# EAGLE design datalogger (EAGLE 5.12)
DATABASE: /home/matthew/work/eagle/partsdb.txt; PARTNO: MAX4820EUP+
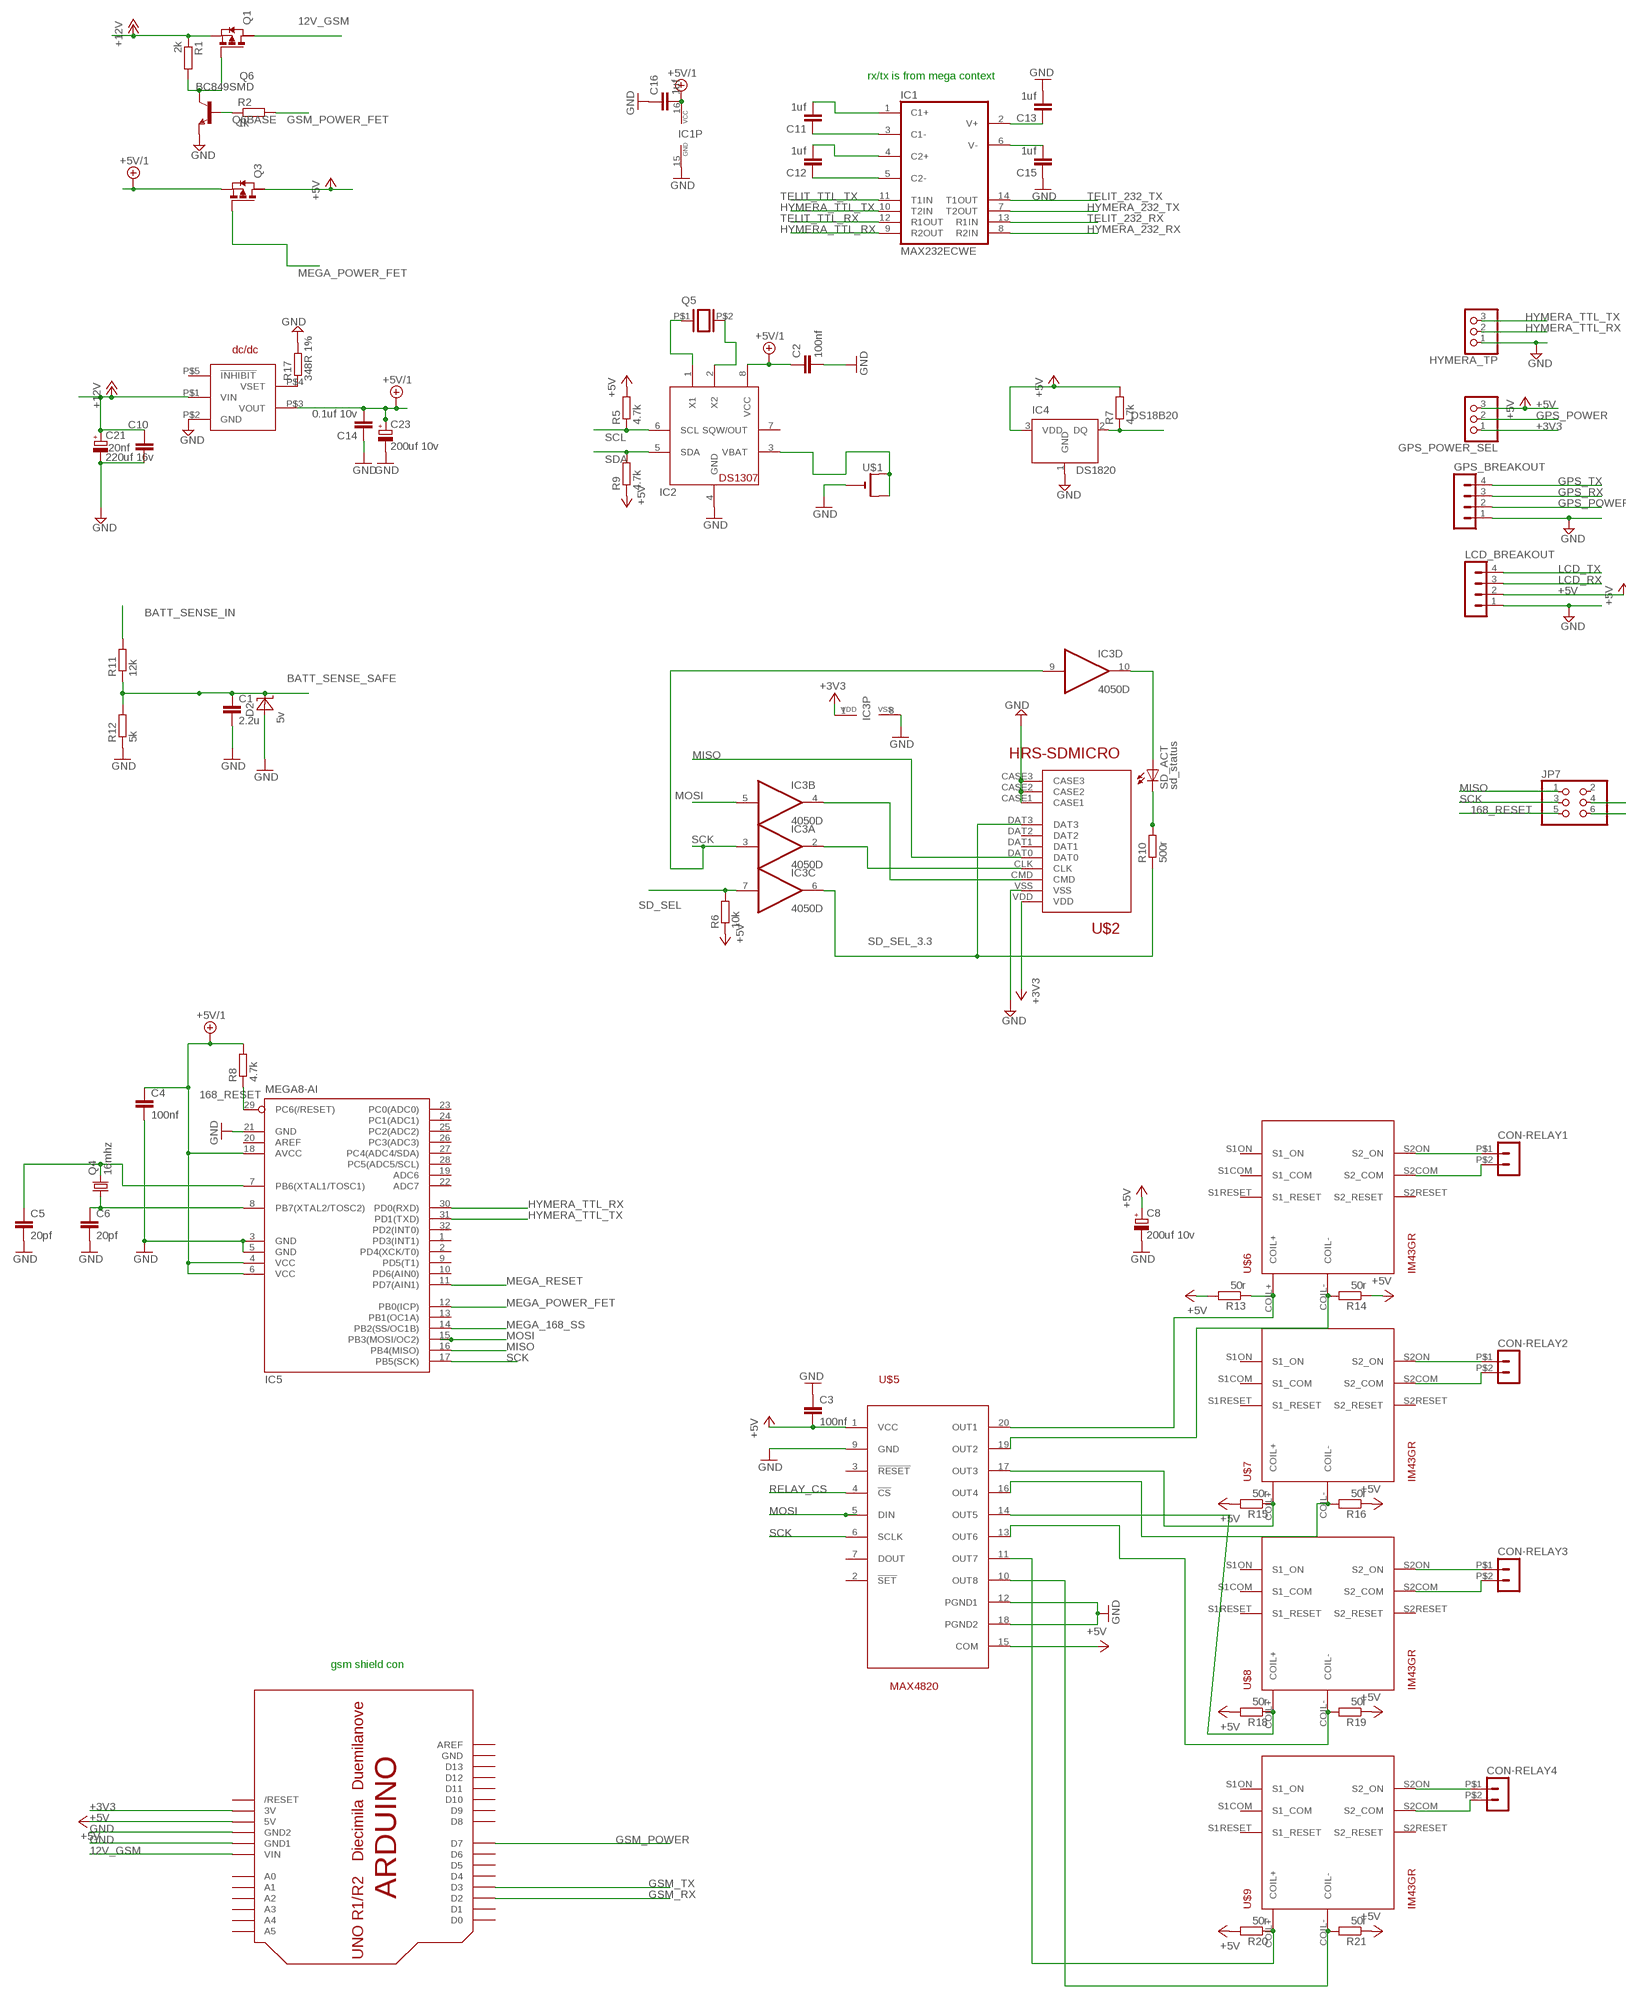
[diagram p0: schematic, sheet 1, part 1 of 3]
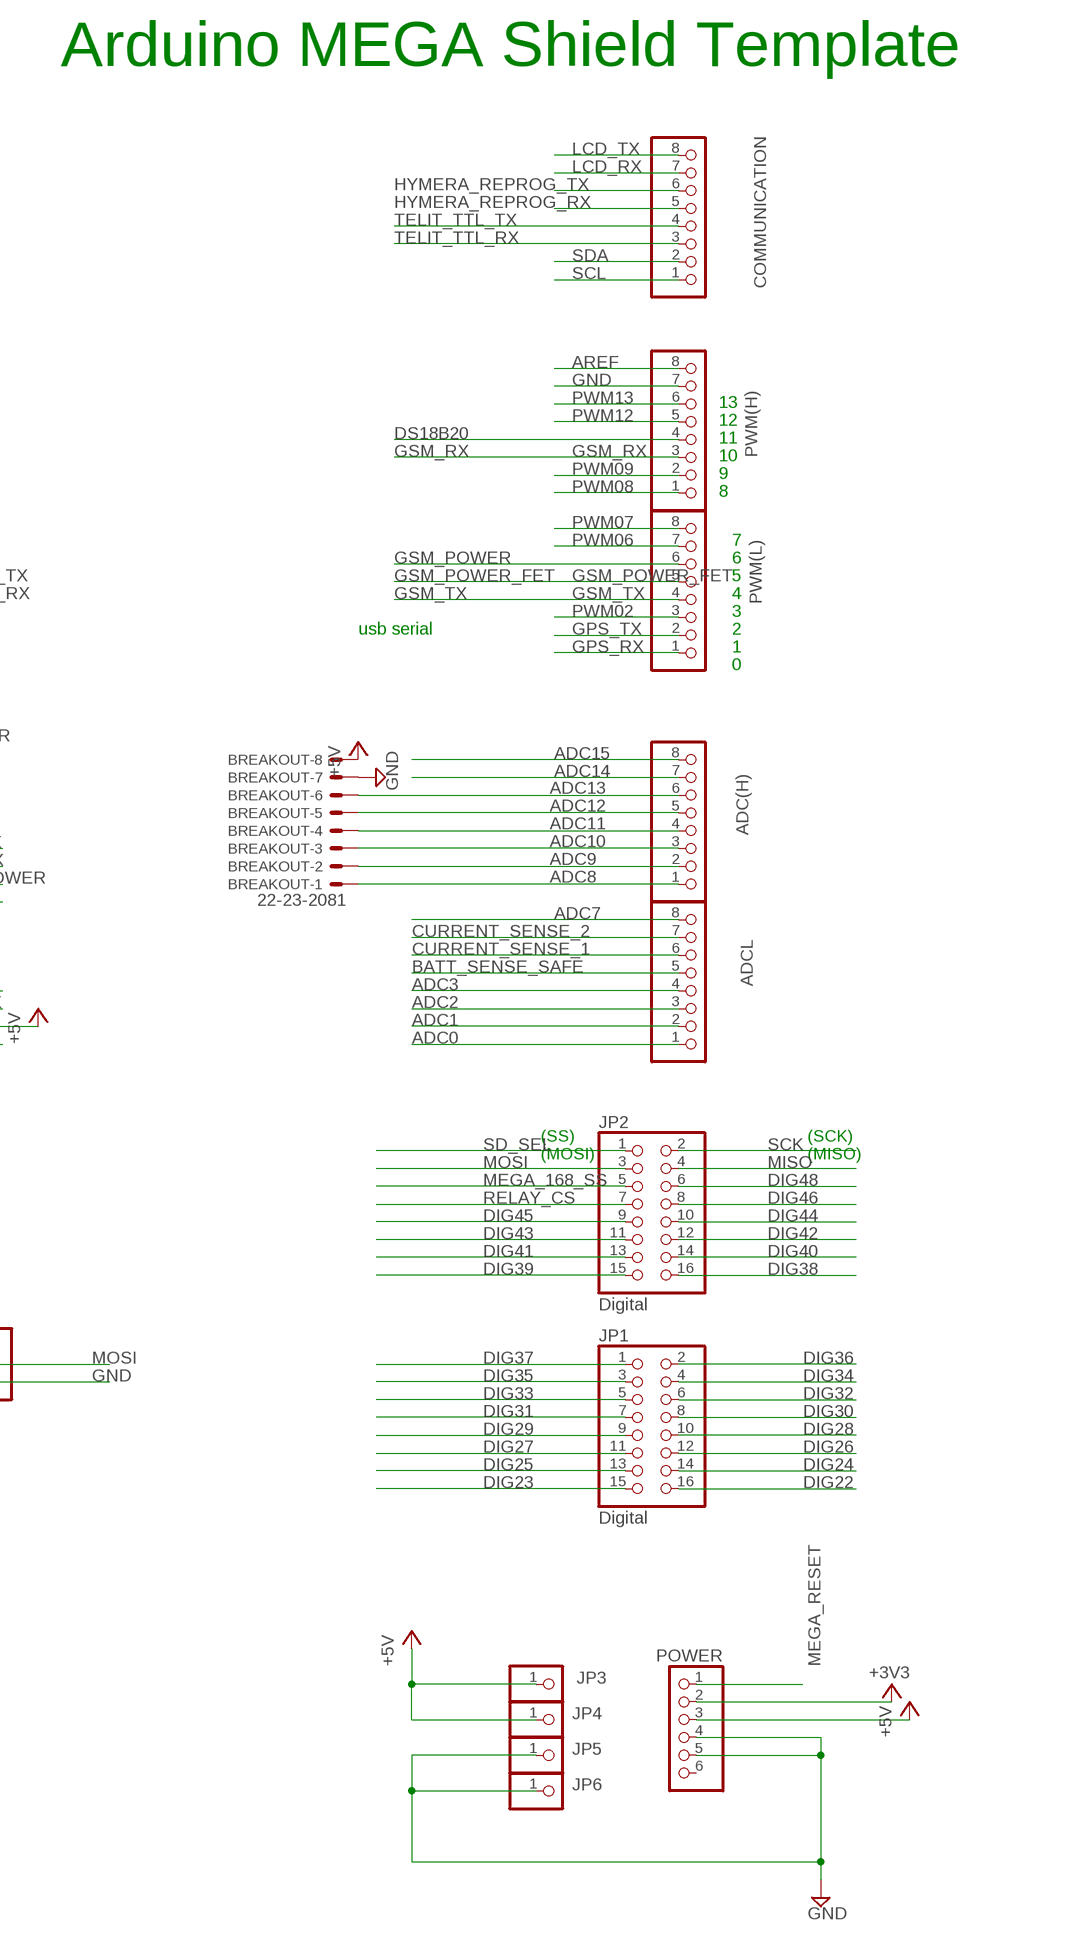
[diagram p1: schematic, sheet 1, part 2 of 3]
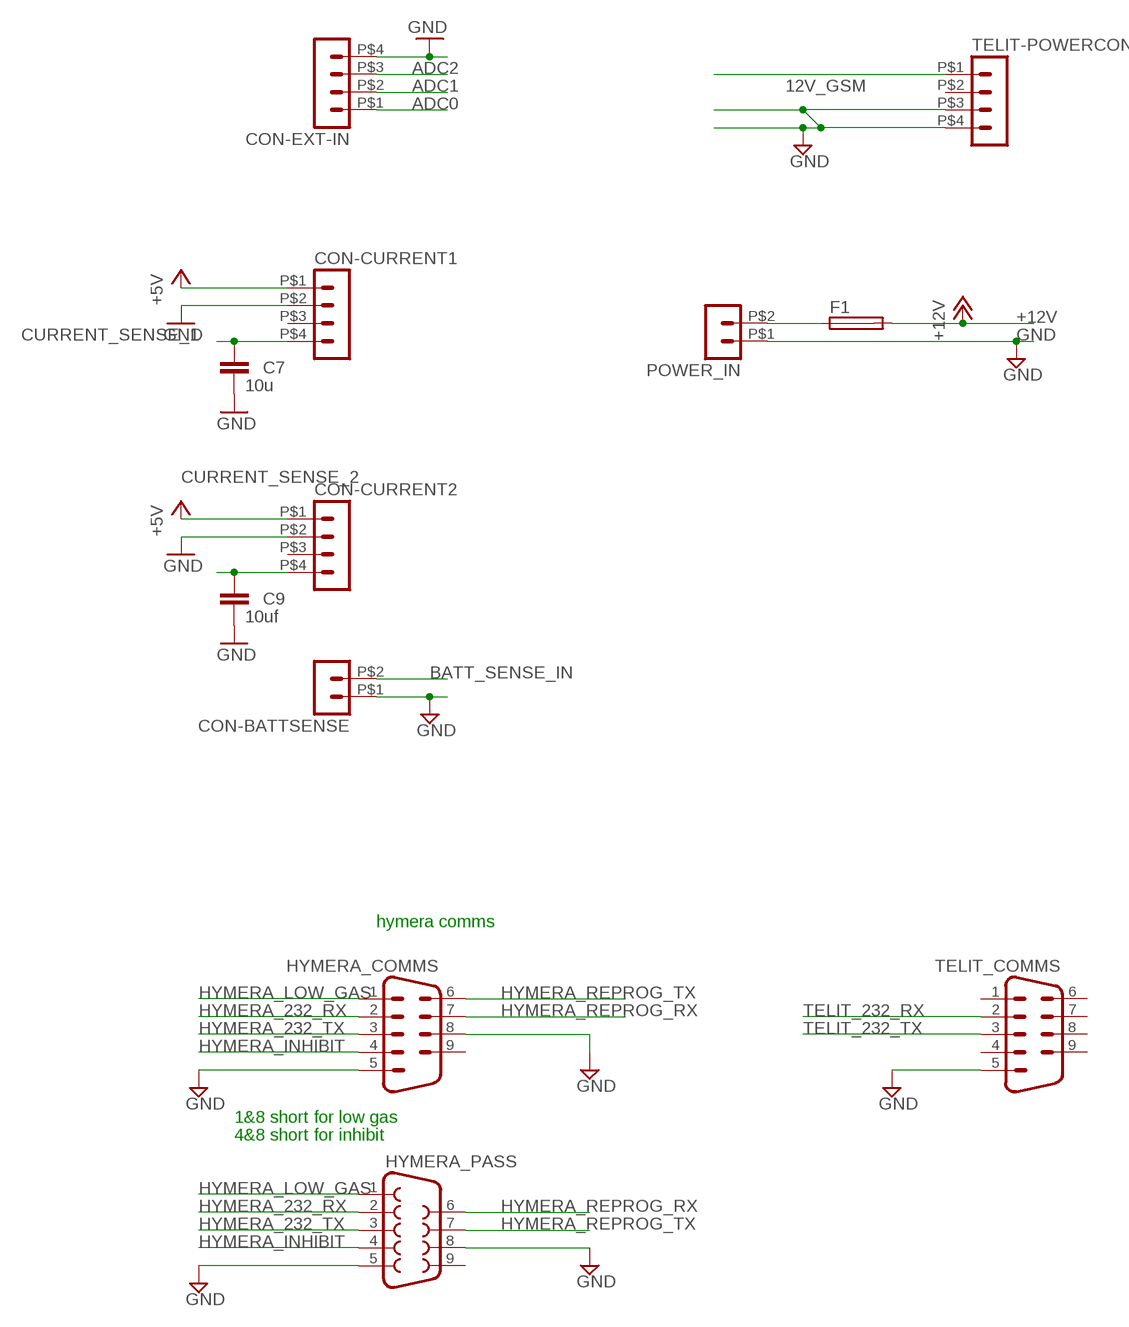
[diagram p2: schematic, sheet 1, part 3 of 3]

## Parts
ADC(H)  PINHD-1X8  [1X08]
ADCL  PINHD-1X8  [1X08]
BREAKOUT  22-23-2081  [22-23-2081]
C1  2.2u  C-EUC1206  [C1206]
C2  100nf  C-EUC1206  [C1206]
C3  100nf  C-EUC1206  [C1206]
C4  100nf  C-EUC1206  [C1206]
C5  20pf  C-EUC1206  [C1206]
C6  20pf  C-EUC1206  [C1206]
C7  10u  C-EUC1206  [C1206]
C8  200uf 10v  CPOL-EU153CLV-0505  [153CLV-0505]
C9  10uf  C-EUC1206  [C1206]
C10  20nf  C-EUC1206  [C1206]
C11  1uf  C-EUC1206  [C1206]
C12  1uf  C-EUC1206  [C1206]
C13  1uf  C-EUC1206  [C1206]
C14  0.1uf 10v  C-EUC1206  [C1206]
C15  1uf  C-EUC1206  [C1206]
C16  1uf  C-EUC1206  [C1206]
C21  220uf 16v  CPOL-EU153CLV-0810  [153CLV-0810]
C23  200uf 10v  CPOL-EU153CLV-0505  [153CLV-0505]
COMMUNICATION  PINHD-1X8  [1X08]
CON-BATTSENSE  HEADER_POS2_43045-0200  [43045-0200]
CON-CURRENT1  HEADER_POS4_43045-0401  [43045-0400]
CON-CURRENT2  HEADER_POS4_43045-0401  [43045-0400]
CON-EXT-IN  HEADER_POS4_43045-0401  [43045-0400]
CON-RELAY1  HEADER_POS2_43045-0200  [43045-0200]
CON-RELAY2  HEADER_POS2_43045-0200  [43045-0200]
CON-RELAY3  HEADER_POS2_43045-0200  [43045-0200]
CON-RELAY4  HEADER_POS2_43045-0200  [43045-0200]
D2  5v  1206ZENER  [C1206]
F1  SH22,5  [SH22,5]
GPS_BREAKOUT  MA04-1  [MA04-1]
GPS_POWER_SEL  PINHD-1X3  [1X03]
HYMERA_COMMS  M09H  [M09H]
HYMERA_PASS  F09H  [F09H]
HYMERA_TP  PINHD-1X3  [1X03]
IC1  MAX232ECWE  [SO16L]
IC2  DS1307  DS1307SOO8  [SO08]
IC3  4050D  [SO16]
IC4  DS1820  [TO-92]
IC5  MEGA8-AI  [TQFP32-08]
JP1  Digital  PINHD-2X8  [2X08]
JP2  Digital  PINHD-2X8  [2X08]
JP3  PINHD-1X1  [1X01]
JP4  PINHD-1X1  [1X01]
JP5  PINHD-1X1  [1X01]
JP6  PINHD-1X1  [1X01]
JP7  PINHD-2X3  [2X03]
LCD_BREAKOUT  MA04-1  [MA04-1]
POWER  PINHD-1X6  [1X06]
POWER_IN  HEADER_POS2_43045-0200  [43045-0200]
PWM(H)  PINHD-1X8  [1X08]
PWM(L)  PINHD-1X8  [1X08]
Q1  PMOSSOT223  [SOT223]
Q3  PMOSSOT223  [SOT223]
Q4  16mhz  CRYSTALHC49UP  [HC49UP]
Q5  XTALSMT  [CC4VCRYSTAL]
Q6  BC849SMD  [SOT23-BEC]
R1  2k  R-EU_M1206  [M1206]
R2  1k  R-EU_M1206  [M1206]
R5  4.7k  R-EU_R1206  [R1206]
R6  10k  R-EU_R1206  [R1206]
R7  4.7k  R-EU_M1206  [M1206]
R8  4.7k  R-EU_R1206  [R1206]
R9  4.7k  R-EU_R1206  [R1206]
R10  500r  R-EU_R1206  [R1206]
R11  12k  R-EU_R1206  [R1206]
R12  5k  R-EU_R1206  [R1206]
R13  50r  R-EU_R1206  [R1206]
R14  50r  R-EU_R1206  [R1206]
R15  50r  R-EU_R1206  [R1206]
R16  50r  R-EU_R1206  [R1206]
R17  348R 1%  R-EU_R1206  [R1206]
R18  50r  R-EU_R1206  [R1206]
R19  50r  R-EU_R1206  [R1206]
R20  50r  R-EU_R1206  [R1206]
R21  50r  R-EU_R1206  [R1206]
SD_ACT  sd_status  LEDSMT1206  [1206]
TELIT-POWERCON  HEADER_POS4_43045-0401  [43045-0400]
TELIT_COMMS  M09H  [M09H]
U$1  CR1220SMT  [CR1220-SMD]
U$2  HRS-SDMICRO  [HRS-MICROSD]
U$3  ARDUINO-NODIM  [ARDUINO-NODIM]
U$4  PTH08080WAH  [PTH08080WAH]
U$5  MAX4820  [TSSOP20]
U$6  IM43GR  [IM43GR]
U$7  IM43GR  [IM43GR]
U$8  IM43GR  [IM43GR]
U$9  IM43GR  [IM43GR]

## Nets
12V_GSM [power]: Q1.2(D) TELIT-POWERCON.P$1 U$3.VIN
168_RESET: IC5.29(PC6(/RESET)) JP7.5 R8.1
+3V3 [power]: GPS_POWER_SEL.1 IC3.1(P:VDD) POWER.2 U$2.VDD U$3.3V
+5V: BREAKOUT.8 C3.2 C8.+ CON-CURRENT1.P$1 CON-CURRENT2.P$1 GPS_POWER_SEL.3 IC4.3(VDD) JP3.1 JP4.1 LCD_BREAKOUT.2 POWER.3 Q3.2(D) R5.2 R6.1 R7.2 R9.1 R13.2 R14.1 R15.2 R16.1 R18.2 R19.1 R20.2 R21.1 U$3.5V U$5.1(VCC) U$5.15(COM)
+5V/1: C2.1 C4.1 C14.2 C16.2 C23.+ IC1.16(VCC) IC2.8(VCC) IC5.4(VCC) IC5.6(VCC) IC5.18(AVCC) Q3.3(S) R8.2 U$4.P$3(VOUT)
+12V [power]: C10.1 C21.+ F1.2 Q1.3(S) R1.1 U$4.P$1(VIN)
ADC0: ADCL.1 CON-EXT-IN.P$1
ADC1: ADCL.2 CON-EXT-IN.P$2
ADC2: ADCL.3 CON-EXT-IN.P$3
ADC3: ADCL.4
ADC7: ADCL.8
ADC8: ADC(H).1 BREAKOUT.1
ADC9: ADC(H).2 BREAKOUT.2
ADC10: ADC(H).3 BREAKOUT.3
ADC11: ADC(H).4 BREAKOUT.4
ADC12: ADC(H).5 BREAKOUT.5
ADC13: ADC(H).6 BREAKOUT.6
ADC14: ADC(H).7
ADC15: ADC(H).8
AREF: PWM(H).8
BATT_SENSE_IN [power]: CON-BATTSENSE.P$2 R11.2
BATT_SENSE_SAFE: ADCL.5 C1.1 D2.CATHODE(C) R11.1 R12.2
CURRENT_SENSE_1: ADCL.6 C7.1 CON-CURRENT1.P$4
CURRENT_SENSE_2: ADCL.7 C9.1 CON-CURRENT2.P$4
DIG22: JP1.16
DIG23: JP1.15
DIG24: JP1.14
DIG25: JP1.13
DIG26 [gnd]: JP1.12
DIG27: JP1.11
DIG28: JP1.10
DIG29: JP1.9
DIG30: JP1.8
DIG31: JP1.7
DIG32: JP1.6
DIG33: JP1.5
DIG34: JP1.4
DIG35: JP1.3
DIG36: JP1.2
DIG37: JP1.1
DIG38: JP2.16
DIG39: JP2.15
DIG40: JP2.14
DIG41: JP2.13
DIG42: JP2.12
DIG43: JP2.11
DIG44: JP2.10
DIG45: JP2.9
DIG46: JP2.8
DIG48: JP2.6
DS18B20: IC4.2(DQ) PWM(H).4 R7.1
GND [gnd]: BREAKOUT.7 C1.2 C2.2 C3.1 C4.2 C5.2 C6.2 C7.2 C8.- C9.2 C10.2 C13.2 C14.1 C15.1 C16.1 C21.- C23.- CON-BATTSENSE.P$1 CON-CURRENT1.P$2 CON-CURRENT2.P$2 CON-EXT-IN.P$4 D2.ANODE(A) GPS_BREAKOUT.1 HYMERA_COMMS.5 HYMERA_COMMS.8 HYMERA_PASS.5 HYMERA_PASS.8 HYMERA_TP.1 IC1.15(GND) IC2.4(GND) IC3.8(P:VSS) IC4.1(GND) IC5.3(GND) IC5.5(GND) IC5.21(GND) JP5.1 JP6.1 JP7.6 LCD_BREAKOUT.1 POWER.4 POWER.5 POWER_IN.P$1 PWM(H).7 Q6.E R12.1 R17.2 TELIT-POWERCON.P$3 TELIT-POWERCON.P$4 TELIT_COMMS.5 U$1.- U$2.CASE1 U$2.CASE2 U$2.CASE3 U$2.VSS U$3.GND1 U$3.GND2 U$4.P$2(GND) U$5.9(GND) U$5.12(PGND1) U$5.18(PGND2)
GPS_POWER: GPS_BREAKOUT.2 GPS_POWER_SEL.2
GPS_RX: GPS_BREAKOUT.3 PWM(L).1
GPS_TX: GPS_BREAKOUT.4 PWM(L).2
GSM_POWER: PWM(L).6 U$3.D7
GSM_POWER_FET: PWM(L).5 R2.2
GSM_RX: PWM(H).3 U$3.D2
GSM_TX: PWM(L).4 U$3.D3
HYMERA_232_RX: HYMERA_COMMS.2 HYMERA_PASS.2 IC1.8(R2IN)
HYMERA_232_TX: HYMERA_COMMS.3 HYMERA_PASS.3 IC1.7(T2OUT)
HYMERA_INHIBIT: HYMERA_COMMS.4 HYMERA_PASS.4
HYMERA_LOW_GAS: HYMERA_COMMS.1 HYMERA_PASS.1
HYMERA_REPROG_RX: COMMUNICATION.5 HYMERA_COMMS.7 HYMERA_PASS.6
HYMERA_REPROG_TX: COMMUNICATION.6 HYMERA_COMMS.6 HYMERA_PASS.7
HYMERA_TTL_RX: HYMERA_TP.2 IC1.9(R2OUT) IC5.30(PD0(RXD))
HYMERA_TTL_TX: HYMERA_TP.3 IC1.10(T2IN) IC5.31(PD1(TXD))
LCD_RX: COMMUNICATION.7 LCD_BREAKOUT.3
LCD_TX: COMMUNICATION.8 LCD_BREAKOUT.4
MEGA_168_SS: IC5.14(PB2(SS/OC1B)) JP2.5
MEGA_POWER_FET: IC5.12(PB0(ICP)) Q3.1(G)
MEGA_RESET: IC5.11(PD7(AIN1)) POWER.1
MISO: IC5.16(PB4(MISO)) JP2.4 JP7.1 U$2.DAT0
MOSI: IC3.5(B:I) IC5.15(PB3(MOSI/OC2)) JP2.3 JP7.4 U$5.5(DIN)
MOSI_3.3: IC3.4(B:O) U$2.CMD
N$2: Q1.1(G) Q6.C R1.2
N$3 [power]: F1.1 POWER_IN.P$2
N$4: CON-RELAY1.P$1 U$6.S2ON(S2_ON)
N$5: R17.1 U$4.P$4(VSET)
N$6: IC2.1(X1) Q5.P$1
N$7: IC2.3(VBAT) U$1.+$1(+) U$1.+$2(+1)
N$8: C6.1 IC5.8(PB7(XTAL2/TOSC2)) Q4.1
N$9: IC2.2(X2) Q5.P$2
N$10: IC3.10(D:O) SD_ACT.A
N$11: C5.1 IC5.7(PB6(XTAL1/TOSC1)) Q4.2
N$12: CON-RELAY1.P$2 U$6.S2COM(S2_COM)
N$14: CON-RELAY2.P$1 U$7.S2ON(S2_ON)
N$15: CON-RELAY2.P$2 U$7.S2COM(S2_COM)
N$16: CON-RELAY3.P$1 U$8.S2ON(S2_ON)
N$17: CON-RELAY3.P$2 U$8.S2COM(S2_COM)
N$18: R10.2 SD_ACT.C
N$19: CON-RELAY4.P$1 U$9.S2ON(S2_ON)
N$20: CON-RELAY4.P$2 U$9.S2COM(S2_COM)
N$21: R13.1 U$5.20(OUT1) U$6.COIL+
N$22: R14.2 U$5.19(OUT2) U$6.COIL-
N$23: R15.1 U$5.17(OUT3) U$7.COIL+
N$24: R16.2 U$5.16(OUT4) U$7.COIL-
N$25: R18.1 U$5.14(OUT5) U$8.COIL+
N$26: R19.2 U$5.13(OUT6) U$8.COIL-
N$27: R20.1 U$5.11(OUT7) U$9.COIL+
N$28: R21.2 U$5.10(OUT8) U$9.COIL-
N$30: C12.1 IC1.5(C2-)
N$31: C12.2 IC1.4(C2+)
N$32: C11.1 IC1.3(C1-)
N$33: C11.2 IC1.1(C1+)
N$34: C13.1 IC1.2(V+)
N$35: C15.2 IC1.6(V-)
PWM02: PWM(L).3
PWM06: PWM(L).7
PWM07: PWM(L).8
PWM08: PWM(H).1
PWM09: PWM(H).2
PWM12: PWM(H).5
PWM13: PWM(H).6
Q6BASE: Q6.B R2.1
RELAY_CS: JP2.7 U$5.4(!CS)
SCK: IC3.3(A:I) IC3.9(D:I) IC5.17(PB5(SCK)) JP2.2 JP7.3 U$5.6(SCLK)
SCK_3.3: IC3.2(A:O) U$2.CLK
SCL: COMMUNICATION.1 IC2.6(SCL) R5.1
SD_SEL: IC3.7(C:I) JP2.1 R6.2
SD_SEL_3.3: IC3.6(C:O) R10.1 U$2.DAT3
SDA: COMMUNICATION.2 IC2.5(SDA) R9.2
TELIT_232_RX: IC1.13(R1IN) TELIT_COMMS.2
TELIT_232_TX: IC1.14(T1OUT) TELIT_COMMS.3
TELIT_TTL_RX: COMMUNICATION.3 IC1.12(R1OUT)
TELIT_TTL_TX: COMMUNICATION.4 IC1.11(T1IN)
Unconnected: CON-CURRENT1.P$3 CON-CURRENT2.P$3 HYMERA_COMMS.9 HYMERA_PASS.9 IC2.7(SQW/OUT) IC3.11(E:I) IC3.12(E:O) IC3.14(F:I) IC3.15(F:O) IC5.1(PD3(INT1)) IC5.2(PD4(XCK/T0)) IC5.9(PD5(T1)) IC5.10(PD6(AIN0)) IC5.13(PB1(OC1A)) IC5.19(ADC6) IC5.20(AREF) IC5.22(ADC7) IC5.23(PC0(ADC0)) IC5.24(PC1(ADC1)) IC5.25(PC2(ADC2)) IC5.26(PC3(ADC3)) IC5.27(PC4(ADC4/SDA)) IC5.28(PC5(ADC5/SCL)) IC5.32(PD2(INT0)) JP7.2 POWER.6 Q1.4(D2) Q3.4(D2) TELIT-POWERCON.P$2 TELIT_COMMS.1 TELIT_COMMS.4 TELIT_COMMS.6 TELIT_COMMS.7 TELIT_COMMS.8 TELIT_COMMS.9 U$2.DAT1 U$2.DAT2 U$3.A0 U$3.A1 U$3.A2 U$3.A3 U$3.A4 U$3.A5 U$3.AREF U$3.D0 U$3.D1 U$3.D4 U$3.D5 U$3.D6 U$3.D8 U$3.D9 U$3.D10 U$3.D11 U$3.D12 U$3.D13 U$3.RESET(/RESET) U$4.P$5(!INHIBIT) U$5.2(!SET) U$5.3(!RESET) U$5.7(DOUT) U$6.S1COM(S1_COM) U$6.S1ON(S1_ON) U$6.S1RESET(S1_RESET) U$6.S2RESET(S2_RESET) U$7.S1COM(S1_COM) U$7.S1ON(S1_ON) U$7.S1RESET(S1_RESET) U$7.S2RESET(S2_RESET) U$8.S1COM(S1_COM) U$8.S1ON(S1_ON) U$8.S1RESET(S1_RESET) U$8.S2RESET(S2_RESET) U$9.S1COM(S1_COM) U$9.S1ON(S1_ON) U$9.S1RESET(S1_RESET) U$9.S2RESET(S2_RESET)

## Notes on the sheet
- Arduino MEGA Shield Template
- rx/tx is from mega context
- 13
- 12
- 11
- 10
- 9
- 8
- 7
- 6
- 5
- 4
- 3
- usb serial | 2
- 1
- 0
- (SS) | (SCK)
- (MOSI) | (MISO)
- gsm shield con
- hymera comms
- 1&8 short for low gas
- 4&8 short for inhibit

## Power pins joined to a net without a drawn wire
GND: U$3.GND

## Library data of the parts
ADC(H) ADCL COMMUNICATION PWM(H) PWM(L) = pinhead:PINHD-1X8: PIN HEADER
BREAKOUT = con-molex:22-23-2081: .100" (2.54mm) Center Header - 8 Pin; MF: MOLEX; MPN: 22-23-2081; OC_FARNELL: 1756826; OC_NEWARK: 01C7592
C1-C7 C9 C11-C13 C15 C16 = matt rcl:C-EU: CAPACITOR, European symbol
C8 C23 = rcl:CPOL-EU: POLARIZED CAPACITOR, European symbol
C10 C14 = resistor:C-EU: CAPACITOR, European symbol
C21 = matt rcl:CPOL-EU: POLARIZED CAPACITOR, European symbol
CON-BATTSENSE CON-RELAY1-CON-RELAY4 POWER_IN = con-molex-5569:HEADER_POS2_?: Molex - Micro-Fit 3.0 Series connector, 3.00mm (0.118") pitch header, 2 positions.
CON-CURRENT1 CON-CURRENT2 CON-EXT-IN TELIT-POWERCON = con-molex-5569:HEADER_POS4_?: Molex - Micro-Fit 3.0 Series connector, 3.00mm (0.118") pitch header, 4 positions.
D2 = matt diode:1206ZENER
F1 = fuse:SH22,5: FUSE HOLDER grid 22,5 mm, OGN0031 8201, Schurter (Buerklin); MF: SCHURTER; MPN: 0031.8201; OC_FARNELL: 1162740; OC_NEWARK: 96F8317
GPS_BREAKOUT LCD_BREAKOUT = con-lstb:MA04-1: PIN HEADER; OC_FARNELL: unknown; OC_NEWARK: unknown
GPS_POWER_SEL HYMERA_TP = adafruit:PINHD-1X3: PIN HEADER
HYMERA_COMMS TELIT_COMMS = con-subd:M09: SUB-D; OC_FARNELL: unknown; OC_NEWARK: unknown
HYMERA_PASS = con-subd:F09: SUB-D; OC_FARNELL: unknown; OC_NEWARK: unknown
IC1 = maxim:MAX232ECWE: RS232 TRANSEIVER; MF: MAXIM; MPN: MAX232ECWE+; OC_FARNELL: 9724435; OC_NEWARK: 67K4440
IC2 = adafruit:DS1307: DS1307 Real time clock (RTC) with battery backup ability. Talk to it via i2c
IC3 = 40xx:4050: Hex non-inverting BUFFER
IC4 = DS1820:DS1820: DS1820 - 1-Wire Digital Thermometer
IC5 = matt atmel:MEGA8: MICROCONTROLLER 8 Kbytes FLASH, 1 kbytes SRAM, 512 bytes EEPROM, USART, 6-channel 10 bit ADC, 2-channel 8 bit ADC Pin compatible with Atmega48, ATMega88, ATMega168 Source: avr.lbr
JP1 JP2 = pinhead:PINHD-2X8: PIN HEADER
JP3-JP6 = pinhead:PINHD-1X1: PIN HEADER
JP7 = pinhead:PINHD-2X3: PIN HEADER
POWER = pinhead:PINHD-1X6: PIN HEADER
Q1 Q3 = zetex:PMOSSOT223: MOS FET; OC_FARNELL: unknown; OC_NEWARK: unknown
Q4 = crystal:CRYSTAL: CRYSTAL; OC_FARNELL: unknown; OC_NEWARK: unknown
Q5 = matt special:XTAL: CRYSTAL
Q6 = matt transistor-npn:BC849*: NPN Transistor
R1 R2 R7 = resistor:R-EU_: RESISTOR, European symbol
R5 R6 R8-R21 = matt rcl:R-EU_: RESISTOR, European symbol
SD_ACT = matt led:LED: LED OSRAM: - CHIPLED LG R971, LG N971, LY N971, LG Q971, LY Q971, LO R971, LY R971 LH N974, LH R974 LS Q976, LO Q976, LY Q976 LO Q996 - Hyper CHIPLED LW Q18S LB Q993, LB Q99A, LB R99A - SideLED LS A670, LO A670, LY A670, LG A670, LP A670 LB A673, LV A673, LT A673, LW A673 LH A674 LY A675 LS A676, LA A676, LO A676, LY A676, LW A676 LS A679, LY A679, LG A679 - Hyper Micro SIDELED® LS Y876, LA Y876, LO Y876, LY Y876 LT Y87S - SmartLED LW L88C, LW L88S LB L89C, LB L89S, LG L890 LS L89K, LO L89K, LY L89K LS L896, LA L896, LO L896, LY L896 - TOPLED LS T670, LO T670, LY T670, LG T670, LP T670 LSG T670, LSP T670, LSY T670, LOP T670, LYG T670 LG T671, LOG T671, LSG T671 LB T673, LV T673, LT T673, LW T673 LH T674 LS T676, LA T676, LO T676, LY T676, LB T676, LH T676, LSB T676, LW T676 LB T67C, LV T67C, LT T67C, LS T67K, LO T67K, LY T67K, LW E67C LS E67B, LA E67B, LO E67B, LY E67B, LB E67C, LV E67C, LT E67C LW T67C LS T679, LY T679, LG T679 LS T770, LO T770, LY T770, LG T770, LP T770 LB T773, LV T773, LT T773, LW T773 LH T774 LS E675, LA E675, LY E675, LS T675 LS T776, LA T776, LO T776, LY T776, LB T776 LHGB T686 LT T68C, LB T68C - Hyper Mini TOPLED® LB M676 - Mini TOPLED Santana® LG M470 LS M47K, LO M47K, LY M47K Source: http://www.osram.convergy.de LUXEON: - LUMILED® LXK2-PW12-R00, LXK2-PW12-S00, LXK2-PW14-U00, LXK2-PW14-V00 LXK2-PM12-R00, LXK2-PM12-S00, LXK2-PM14-U00 LXK2-PE12-Q00, LXK2-PE12-R00, LXK2-PE12-S00, LXK2-PE14-T00, LXK2-PE14-U00 LXK2-PB12-K00, LXK2-PB12-L00, LXK2-PB12-M00, LXK2-PB14-N00, LXK2-PB14-P00, LXK2-PB14-Q00 LXK2-PR12-L00, LXK2-PR12-M00, LXK2-PR14-Q00, LXK2-PR14-R00 LXK2-PD12-Q00, LXK2-PD12-R00, LXK2-PD12-S00 LXK2-PH12-R00, LXK2-PH12-S00 LXK2-PL12-P00, LXK2-PL12-Q00, LXK2-PL12-R00 Source: www.luxeon.com KINGBRIGHT: KA-3528ASYC Source: www.kingbright.com
U$1 = adafruit:CR1220: CR1216/CR1220/CR1225 12mm 3V lithium coin cell Great for battery packup. Both SMT and THM holders. Note the THM package has the ground pads on both sides of the PCB so that the masks are the same - this reduces the cost
U$2 = matt:HRS-SDMICRO
U$3 = adafruit:ARDUINO: Arduino Diecimila/Duemilanove Make a shield with ease, this package has all the named pins as well as the two mounting drill holes and an outline of the USB and DC power connector. The outline is on the DIMENSION layer, so if your board house uses it they will cut the outline to match. http://www.ladyada.net/library/pcb/eaglelibrary.html
U$4 = matt:PTH08080WAH
U$5 = matt:MAX4820
U$6-U$9 = matt:IM43GR

## Net classes
0 default: width 0.203 mm, drill 0.406 mm, clearance 0.203 mm
1 power: width 0.61 mm, drill 0.711 mm, clearance 0.203 mm
2 gnd: width 0.305 mm, drill 0.711 mm, clearance 0.203 mm
3 usbvcc: width 0.508 mm, drill 0.711 mm, clearance 0.203 mm

## Board
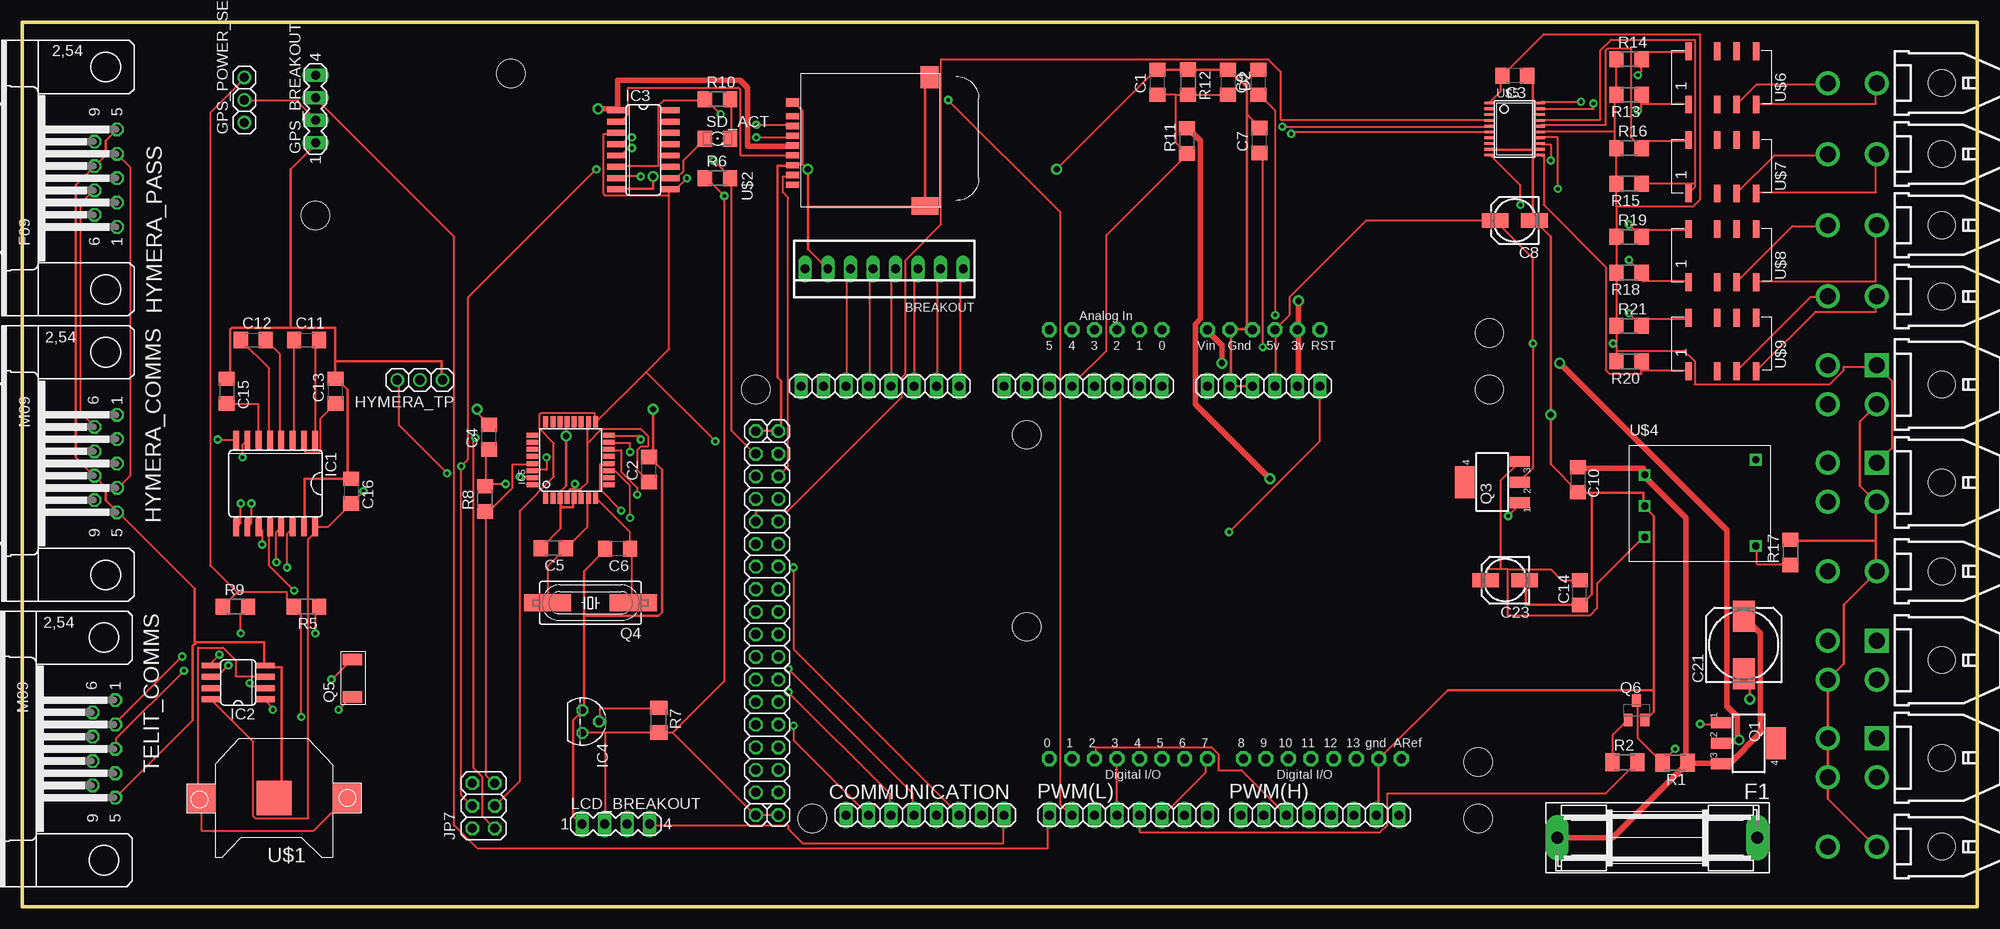
[diagram p3: board, top side]
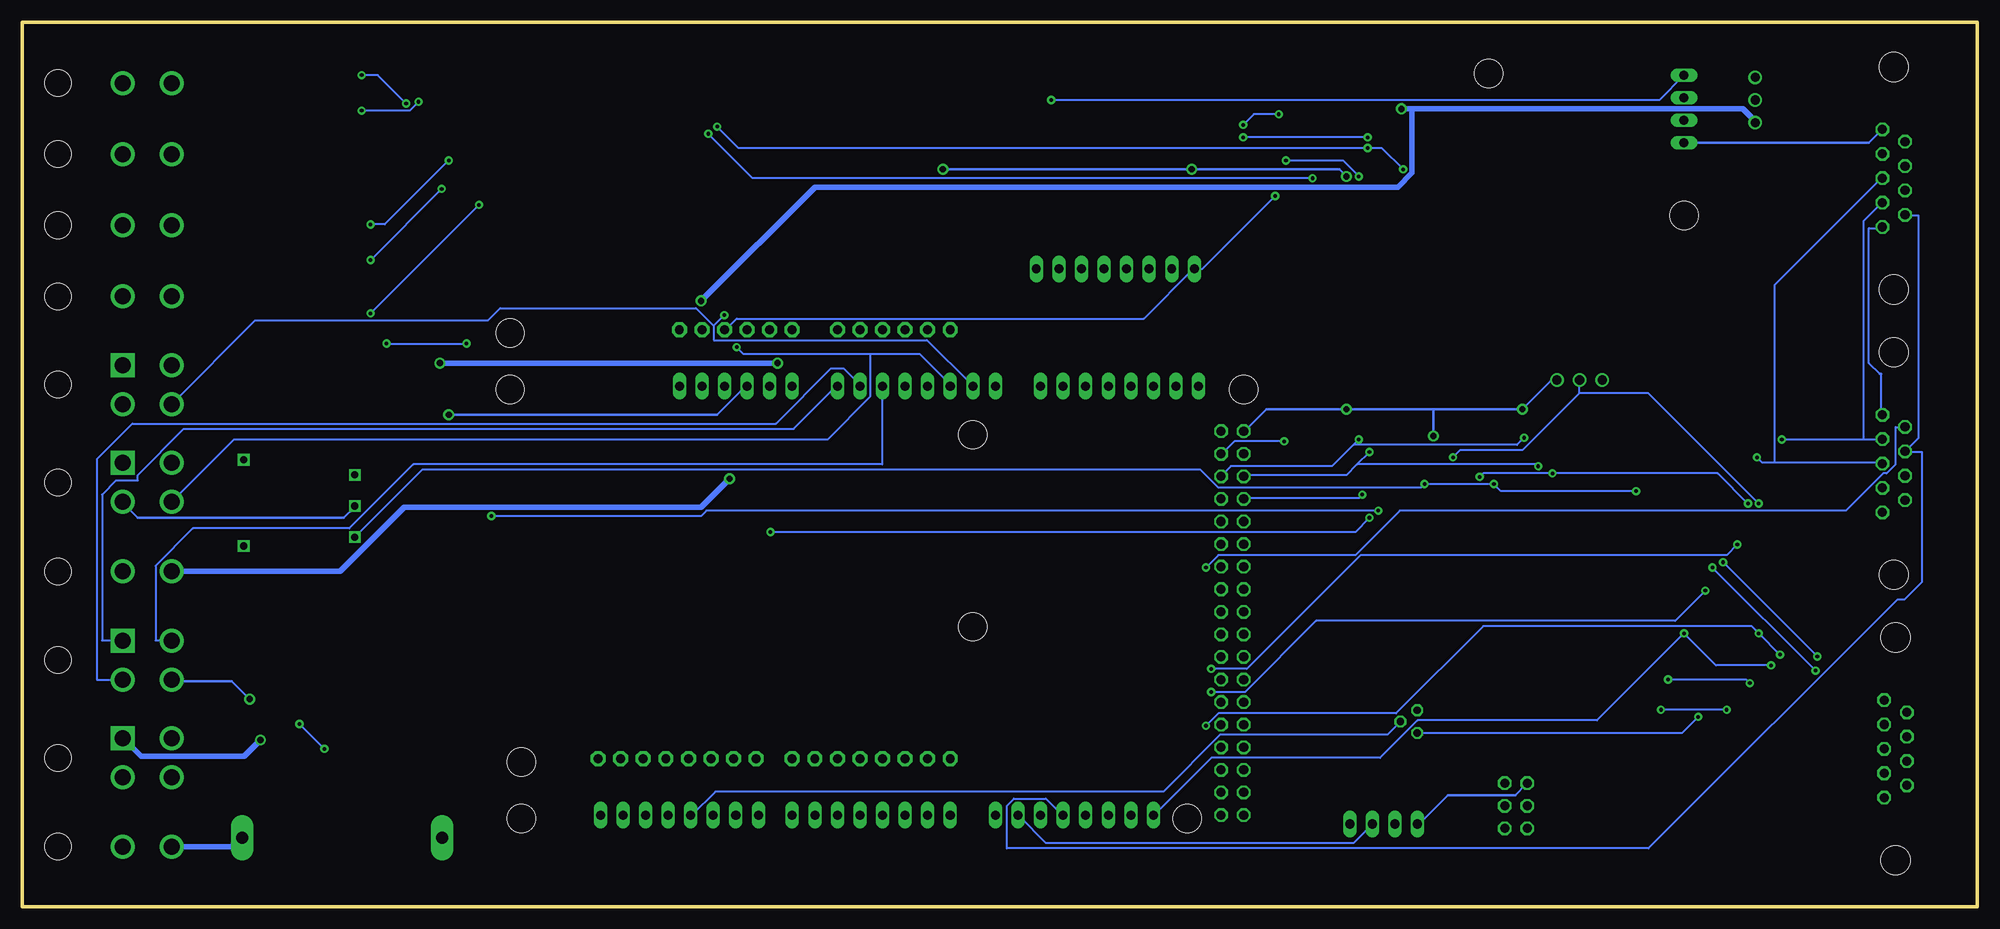
[diagram p4: board, bottom side, seen from below]

Size 220 x 99.5 mm. Coordinates in mm from the lower left corner, seen from the top.
Outline: 0,99.5 0,0 220,0 220,99.5 0,99.5
Copper layers (1*16): Top 0.035mm / dielectric 1.5mm / Bottom 0.035mm
Design rules "default *": minimum track width 8mil, minimum drill 16mil, track to track 8mil, track to pad 8mil, pad to pad 8mil, via to via 10mil, smd to smd 8mil, copper to edge 40mil, drill to drill 12mil, minimum pad ring 10mil, minimum via ring 10mil, stop-mask expansion 4mil, vias tented up to drill 0mil, thermal gap 10mil
Holes 3.2 mm at 55,93.75 33,77.75 165.1,58.17 113.03,53.09 82.55,58.17 88.9,9.91 163.83,9.91 163.83,16.26 165.1,64.52 113.03,31.5

### Footprints (pad centres in the part's own frame; a part is rotated, then mirrored left to right if it is on the bottom)
1X08 = drill 1.016 long: 1 -8.89,0; 2 -6.35,0; 3 -3.81,0; 4 -1.27,0; 5 1.27,0; 6 3.81,0; 7 6.35,0; 8 8.89,0
22-23-2081 = drill 1 long: 1 -8.89,0; 2 -6.35,0; 3 -3.81,0; 4 -1.27,0; 5 1.27,0; 6 3.81,0; 7 6.35,0; 8 8.89,0
C1206 = smd 1.6 x 1.8: 1 -1.4,0; 2 1.4,0
153CLV-0505 = smd 3 x 1.6: + 2.2,0; - -2.2,0
153CLV-0810 = smd 3.5 x 2.5: + 3.25,0; - -3.25,0
43045-0200 = drill 1.8 round: P$1 0,7.32; P$2 0,12.82 | hole 3: 0,0
43045-0400 = drill 1.8 square: P$1 2.2,7.3 | drill 1.8 round: P$2 -2.2,7.3; P$3 2.2,12.8; P$4 -2.2,12.8 | hole 3: 0,0
C1206' = smd 1.6 x 1.8: ANODE -1.4,0; CATHODE 1.4,0
SH22,5 = drill 1.321 pad 2.54 long: 1 -11.252,0; 2 11.252,0
MA04-1 = drill 1.016 long: 1 -3.81,0; 2 -1.27,0; 3 1.27,0; 4 3.81,0
1X03 = drill 1.016 round: 1 -2.54,0; 2 0,0; 3 2.54,0
M09H = drill 1.016 octagon: 1 -5.486,1.27; 2 -2.743,1.27; 3 0,1.27; 4 2.743,1.27; 5 5.486,1.27; 6 -4.115,-1.27; 7 -1.372,-1.27; 8 1.372,-1.27; 9 4.115,-1.27 | hole 3.302: 12.522,0; -12.522,0
F09H = drill 1.016 octagon: 1 -5.486,-1.27; 2 -2.743,-1.27; 3 0,-1.27; 4 2.743,-1.27; 5 5.486,-1.27; 6 -4.115,1.27; 7 -1.372,1.27; 8 1.372,1.27; 9 4.115,1.27 | hole 3.302: -12.522,0; 12.522,0
SO16L = smd 0.66 x 2.032: 1 -4.445,-4.902; 2 -3.175,-4.902; 3 -1.905,-4.902; 4 -0.635,-4.902; 5 0.635,-4.902; 6 1.905,-4.902; 7 3.175,-4.902; 8 4.445,-4.902; 9 4.445,4.902; 10 3.175,4.902; 11 1.905,4.902; 12 0.635,4.902; 13 -0.635,4.902; 14 -1.905,4.902; 15 -3.175,4.902; 16 -4.445,4.902
SO08 = smd 0.66 x 2.032: 1 -1.905,-3.073; 2 -0.635,-3.073; 3 0.635,-3.073; 4 1.905,-3.073; 5 1.905,3.073; 6 0.635,3.073; 7 -0.635,3.073; 8 -1.905,3.073
SO16 = smd 0.66 x 2.032: 1 -4.445,-3.073; 2 -3.175,-3.073; 3 -1.905,-3.073; 4 -0.635,-3.073; 5 0.635,-3.073; 6 1.905,-3.073; 7 3.175,-3.073; 8 4.445,-3.073; 9 4.445,3.073; 10 3.175,3.073; 11 1.905,3.073; 12 0.635,3.073; 13 -0.635,3.073; 14 -1.905,3.073; 15 -3.175,3.073; 16 -4.445,3.073
TO-92 = drill 0.813 pad 1.27 octagon: 1 -1.27,0; 2 0,1.905; 3 1.27,0
TQFP32-08 = smd 1.27 x 0.559: 1 -4.293,2.8; 2 -4.293,2; 3 -4.293,1.2; 4 -4.293,0.4; 5 -4.293,-0.4; 6 -4.293,-1.2; 7 -4.293,-2; 8 -4.293,-2.8; 17 4.293,-2.8; 18 4.293,-2; 19 4.293,-1.2; 20 4.293,-0.4; 21 4.293,0.4; 22 4.293,1.2; 23 4.293,2; 24 4.293,2.8 | smd 0.559 x 1.27: 9 -2.8,-4.293; 10 -2,-4.293; 11 -1.2,-4.293; 12 -0.4,-4.293; 13 0.4,-4.293; 14 1.2,-4.293; 15 2,-4.293; 16 2.8,-4.293; 25 2.8,4.293; 26 2,4.293; 27 1.2,4.293; 28 0.4,4.293; 29 -0.4,4.293; 30 -1.2,4.293; 31 -2,4.293; 32 -2.8,4.293
2X08 = drill 1.016 octagon: 1 -8.89,-1.27; 2 -8.89,1.27; 3 -6.35,-1.27; 4 -6.35,1.27; 5 -3.81,-1.27; 6 -3.81,1.27; 7 -1.27,-1.27; 8 -1.27,1.27; 9 1.27,-1.27; 10 1.27,1.27; 11 3.81,-1.27; 12 3.81,1.27; 13 6.35,-1.27; 14 6.35,1.27; 15 8.89,-1.27; 16 8.89,1.27
1X01 = drill 1.016 octagon: 1 0,0
2X03 = drill 1.016 octagon: 1 -2.54,-1.27; 2 -2.54,1.27; 3 0,-1.27; 4 0,1.27; 5 2.54,-1.27; 6 2.54,1.27
1X06 = drill 1.016 long: 1 -6.35,0; 2 -3.81,0; 3 -1.27,0; 4 1.27,0; 5 3.81,0; 6 6.35,0
SOT223 = smd 1.219 x 2.235: 1 -2.311,-3.099; 2 0,-3.099; 3 2.311,-3.099 | smd 3.6 x 2.2: 4 0,3.099
HC49UP = smd 5.334 x 1.93: 1 -4.826,0; 2 4.826,0
CC4VCRYSTAL = smd 1.3 x 2.2: P$1 -2.5,0; P$2 1.7,0
SOT23-BEC = smd 1 x 1.4: B -0.95,-1.1; C 0,1.1; E 0.95,-1.1
M1206 = smd 1.6 x 2: 1 -1.4,0; 2 1.4,0
R1206 = smd 1.6 x 1.803: 1 -1.422,0; 2 1.422,0
1206 = smd 1.6 x 1.803: A -1.422,0; C 1.422,0
CR1220-SMD = smd 3.2 x 3.2: +$1 -8.2,0; +$2 8.2,0 | smd 3.9 x 3.9: - 0,0
HRS-MICROSD = smd 1 x 1.5: CASE1 5.95,1.9 | smd 2 x 3: CASE2 -5.7,-13 | smd 2.5 x 2: CASE3 8.8,-13.5 | smd 0.7 x 1.5: CLK 0,1.9; CMD 2.2,1.9; DAT0 -2.2,1.9; DAT1 -3.3,1.9; DAT2 4.4,1.9; DAT3 3.3,1.9; VDD 1.1,1.9; VSS -1.1,1.9
ARDUINO-NODIM = drill 1 pad 1.676 octagon: 3V -11.43,-25.4; 5V -8.89,-25.4; A0 3.81,-25.4; A1 6.35,-25.4; A2 8.89,-25.4; A3 11.43,-25.4; A4 13.97,-25.4; A5 16.51,-25.4; AREF -23.114,22.86; D0 16.51,22.86; D1 13.97,22.86; D2 11.43,22.86; D3 8.89,22.86; D4 6.35,22.86; D5 3.81,22.86; D6 1.27,22.86; D7 -1.27,22.86; D8 -5.334,22.86; D9 -7.874,22.86; D10 -10.414,22.86; D11 -12.954,22.86; D12 -15.494,22.86; D13 -18.034,22.86; GND -20.574,22.86; GND1 -3.81,-25.4; GND2 -6.35,-25.4; RESET -13.97,-25.4; VIN -1.27,-25.4
PTH08080WAH = drill 0.8 square: P$1 1.8,9.7; P$2 1.8,6.2; P$3 1.8,2.7; P$4 14.3,1.7; P$5 14.3,11.4
TSSOP20 = smd 0.305 x 0.991: 1 -2.925,-2.918; 2 -2.275,-2.918; 3 -1.625,-2.918; 4 -0.975,-2.918; 5 -0.325,-2.918; 6 0.325,-2.918; 7 0.975,-2.918; 8 1.625,-2.918; 9 2.275,-2.918; 10 2.925,-2.918; 11 2.925,2.918; 12 2.275,2.918; 13 1.625,2.918; 14 0.975,2.918; 15 0.325,2.918; 16 -0.325,2.918; 17 -0.975,2.918; 18 -1.625,2.918; 19 -2.275,2.918; 20 -2.925,2.918
IM43GR = smd 0.7 x 2: COIL+ -4.3,-3.1; COIL- -4.3,2.9; S1COM 1.1,2.9; S1ON 3.3,2.9; S1RESET -1.1,2.9; S2COM 1.1,-3.1; S2ON 3.3,-3.1; S2RESET -1.1,-3.1

### Placement (x,y rotation side)
ADC(H)  96.52,58.57 180 top
ADCL  119.38,58.57 180 top
BREAKOUT  97,71.75 180 top
C1  127.74,92.75 90 top
C2  70.56,49.18 90 top
C3  167.95,93.48 180 top
C4  52.52,52.83 90 top
C5  59.77,40.3 180 top
C6  67,40.25 180 top
C7  139.24,86.19 90 top
C8  167.96,77.19 180 top
C9  139.12,92.75 90 top
C10  175.06,48.03 270 top
C11  32,63.75 0 top
C12  26,63.75 0 top
C13  35.25,58 90 top
C14  175.25,35.33 90 top
C15  23,58 270 top
C16  37,46.75 270 top
C21  193.73,29.44 90 top
C23  166.88,36.72 180 top
COMMUNICATION  101.6,10.31 0 top
CON-BATTSENSE  216,37.73 90 top
CON-CURRENT1  216,47.73 90 top
CON-CURRENT2  216,58.73 90 top
CON-EXT-IN  216,27.73 90 top
CON-RELAY1  216,92.66 90 top
CON-RELAY2  216,84.66 90 top
CON-RELAY3  216,76.66 90 top
CON-RELAY4  216,68.66 90 top
D2  5v  [C1206']  135.66,92.75 270 top
F1  184,7.75 180 top
GPS_BREAKOUT  33,89.75 90 top
GPS_POWER_SEL  25,90.75 90 top
HYMERA_COMMS  9.4,49.85 270 top
HYMERA_PASS  9.4,81.95 90 top
HYMERA_TP  44.75,59.25 180 top
IC1  28.52,47.59 180 top
IC2  24.3,25.23 90 top
IC3  69.89,85.14 270 top
IC4  63.02,20.82 270 top
IC5  61.72,50.25 90 top
JP1  83.82,21.74 270 top
JP2  83.82,42.06 270 top
JP3  85.09,10.31 180 top
JP4  82.55,10.31 180 top
JP5  85.09,53.49 180 top
JP6  82.55,53.49 180 top
JP7  51.91,11.35 90 top
LCD_BREAKOUT  66.79,9.3 0 top
POWER  139.7,58.57 180 top
POWER_IN  216,6.75 90 top
PWM(H)  146.05,10.31 0 top
PWM(L)  124.46,10.31 0 top
Q1  194.26,18.38 270 top
Q3  165.42,47.77 90 top
Q4  63.95,34.17 180 top
Q5  37.17,26.11 90 top
Q6  181.66,22.09 0 top
R1  185.99,16.2 180 top
R2  180.34,16.26 0 top
R5  32,33.75 180 top
R6  78.25,81.97 0 top
R7  71.62,20.98 270 top
R8  52.08,45.88 90 top
R9  24,33.75 0 top
R10  78.25,90.86 0 top
R11  131.06,86.16 90 top
R12  131.2,92.75 270 top
R13  180.81,91.34 180 top
R14  180.81,95.34 0 top
R15  180.81,81.34 180 top
R16  180.81,85.34 0 top
R17  198.97,39.87 90 top
R18  180.81,71.34 180 top
R19  180.81,75.34 0 top
R20  180.81,61.34 180 top
R21  180.81,65.34 0 top
SD_ACT  78.25,86.41 0 top
TELIT-POWERCON  216,16.75 90 top
TELIT_COMMS  9.2,17.75 270 top
U$1  28.36,12.22 180 top
U$2  88.58,84.52 90 top
U$3  132.08,39.52 180 top
U$4  180.78,38.88 0 top
U$5  167.95,87.48 270 top
U$6  191.81,93.34 0 top
U$7  191.81,83.34 0 top
U$8  191.81,73.34 0 top
U$9  191.81,63.34 0 top

### Tracks (layer width: path | path; a pad name or v marks a point on that pad's centre or on a via)
12V_GSM  (via drill 0.71)
  Top 0.61: Q1.2 191.2,18.55 193.2,18.55 v193.2,18.75 193,18.95 193,21.35 191.8,22.55 191.8,42.35 v173,61.15 | v135,61.15 135,63.15 133.4,64.75 U$3.VIN
  Bottom 0.61: v193.2,18.75 195,16.95 206.6,16.95 208.6,18.95 TELIT-POWERCON.P$1 | v135,61.15 v173,61.15
168_RESET
  Top 0.203: IC5.29 57.4,49.75 55.2,49.75 55.2,47.15 52.6,44.55 52.2,44.55 R8.1 52.2,44.35 52.2,14.75 53,13.95 JP7.5
+3V3  (via drill 0.71)
  Top 0.61: POWER.2 143.6,58.75 143.6,64.75 U$3.3V 143.6,65.15 v143.6,68.15 | U$2.VDD 86.6,85.55 81.6,85.55 81.6,92.15 80.8,92.95 67,92.95 67,89.75 IC3.1 66.6,89.75 v64.8,89.75
  Bottom 0.61: 63.6,89.75 v64.8,89.75 | 63.6,89.75 26.4,89.75 25,88.35 GPS_POWER_SEL.1 | v143.6,68.15 130.8,80.95 65.2,80.95 63.6,82.55 63.6,89.75
+5V  (via drill 0.41)
  Top 0.203: CON-CURRENT1.P$1 208.8,49.95 210.4,51.55 210.4,59.15 208.8,60.75 CON-CURRENT2.P$1 208.6,60.75 205,60.75 205,60.35 203.4,58.75 188.2,58.75 188.2,61.35 187,62.55 179.4,62.55 | 179.4,63.35 179.4,65.15 R21.1 179.4,71.15 R18.2 179.4,75.15 R19.1 179.4,78.75 | 179.4,63.35 179.4,62.55 | 179.4,62.55 R20.2 | R14.1 179.4,95.15 R13.2 179.2,91.15 179.2,87.15 | U$5.1 165.2,90.55 166.4,91.75 166.4,93.35 C3.2 166.6,93.55 171.2,98.15 188.8,98.15 188.8,79.55 188,78.75 179.4,78.75 | 179.2,87.15 171,87.15 U$5.15 | 179.2,87.15 179.2,85.35 R16.1 179.4,85.15 R15.2 179.4,81.15 179.4,78.75 | 24.2,35.35 22.6,33.75 R9.1 | 24.2,35.35 29.8,35.35 29.8,34.35 30.4,33.75 R5.2 30.6,33.75 31.4,32.95 v31.4,21.35 | 24.2,35.35 21.2,38.35 21.2,89.35 25,93.15 GPS_POWER_SEL.3 | JP3.1 85,10.35 82.6,10.35 JP4.1 82.4,10.35 73.2,19.55 | 65.6,19.55 71.6,19.55 R7.2 71.8,19.55 73.2,19.55 | 65.6,19.55 IC4.3 | 65.6,19.55 65.6,9.35 LCD_BREAKOUT.2 | R6.1 77,81.95 v79,79.95 79,25.35 73.2,19.55 | POWER.3 141,58.75 141,64.75 U$3.5V 142.6,66.55 142.6,68.55 151.2,77.15 165.6,77.15 C8.+ 170,72.95 v170,63.35 170,49.35 168.6,47.95 Q3.2 | 179.4,63.35 v179,63.35
  Bottom 0.203: v79,79.95 87.2,71.75 BREAKOUT.8 88.2,71.75 93.8,66.15 139.6,66.15 140.8,64.95 U$3.5V | v31.4,21.35 33.2,19.55 IC4.3 | v179,63.35 v170,63.35
+5V/1  (via drill 0.41)
  Top 0.203: 166.4,37.95 164.8,37.95 164.8,36.75 C23.+ | 167.2,37.95 166.4,37.95 | 167.2,37.95 172,37.95 173.2,36.75 175.2,36.75 C14.2 | 166.4,37.95 166.4,47.95 168.4,49.95 Q3.3 | 167.2,37.95 167.2,32.75 176.4,32.75 177.2,33.55 177.2,36.35 182.4,41.55 U$4.P$3 | 52.2,47.55 52.2,47.35 R8.2 52.2,47.55 | 52.2,47.55 52.2,51.15 52.4,51.35 C4.1 | 62.2,46.95 62.8,46.95 | 62.2,46.95 61.6,46.95 61.4,46.75 61.4,46.15 IC5.4 | 62.8,46.95 62.8,46.15 IC5.6 | 63.6,52.15 63.6,47.75 62.8,46.95 | 63.6,52.15 63.6,54.35 IC5.18 | 63.6,52.15 65.2,53.75 69.6,53.75 70.4,52.95 70.4,51.75 69.6,51.75 69.2,51.35 69.2,49.15 70.4,47.95 C2.1 | v54.4,47.55 52.2,47.55 | v62.2,47.55 62.2,46.95 | IC2.8 21.4,23.15 26,18.55 26,10.15 26.2,9.95 32.2,9.95 32.2,41.35 32.8,41.95 32.8,42.55 IC1.16 33,42.75 34.4,42.75 C16.2 v38.4,46.75
  Bottom 0.203: v38.4,46.75 53.6,46.75 v54.4,47.55 v62.2,47.55 62.6,47.15 85.4,47.15 87.4,49.15 175,49.15 182.4,41.75 U$4.P$3
+12V
  Top 0.61: C10.1 175.2,49.35 182.4,49.35 182.4,48.75 U$4.P$1 182.6,48.35 187.2,43.75 187.2,16.35 R1.1 | R1.1 187.4,16.15 191,16.15 Q1.3 191.4,16.15 192.2,16.15 195.6,19.55 195.6,30.75 193.8,32.55 C21.+ | R1.1 187.2,15.95 179,7.75 F1.2
ADC0
  Bottom 0.203: ADCL.1 128.4,58.55 133.2,53.75 201.8,53.75 207,48.55 207,47.95 209.4,47.95 211,46.35 211,29.95 208.8,29.95 CON-EXT-IN.P$1
ADC1
  Bottom 0.203: ADCL.2 125.8,58.75 127.6,60.55 129,60.55 135.2,54.35 207.6,54.35 211.6,50.35 211.6,25.55 208.8,25.55 CON-EXT-IN.P$2
ADC2
  Bottom 0.203: ADCL.3 123.2,58.55 123.2,49.75 176,49.75 183.2,42.55 200.8,42.55 205,38.35 205,29.95 203.2,29.95 CON-EXT-IN.P$3
ADC8
  Top 0.203: BREAKOUT.1 105.8,71.75 105.6,71.55 105.6,58.75 ADC(H).1
ADC9
  Top 0.203: BREAKOUT.2 103.2,71.75 103,71.55 103,58.75 ADC(H).2
ADC10
  Top 0.203: BREAKOUT.3 100.4,71.35 100.4,58.75 ADC(H).3
ADC11
  Top 0.203: BREAKOUT.4 98.2,71.75 97.8,71.35 97.8,58.75 ADC(H).4
ADC12
  Top 0.203: BREAKOUT.5 95.6,71.75 95.4,71.55 95.4,58.75 ADC(H).5
ADC13
  Top 0.203: BREAKOUT.6 93,71.75 92.8,71.55 92.8,58.75 ADC(H).6
BATT_SENSE_IN  (via drill 0.71)
  Top 0.61: v140.4,48.15 132,56.55 132,65.55 132.6,66.15 132.6,86.15 131.2,87.55 R11.2
  Bottom 0.61: v140.4,48.15 143.6,44.95 177,44.95 184.2,37.75 203,37.75 CON-BATTSENSE.P$2
BATT_SENSE_SAFE
  Top 0.203: 129.8,91.35 131.2,91.35 | 129.8,91.35 C1.1 | 131.2,91.35 D2.CATHODE | 131.2,91.35 R12.2 | 129.8,91.35 129.8,85.95 131,84.75 R11.1 131,84.55 122,75.55 122,62.55 118.2,58.75 ADCL.5
CURRENT_SENSE_1  (via drill 0.41)
  Top 0.203: v139.6,62.95 139.6,84.55 139.4,84.75 C7.1
  Bottom 0.203: v139.6,62.95 138.8,62.15 124.6,62.15 | 124.6,62.15 119,62.15 115.6,58.75 ADCL.6 | 124.6,62.15 124.6,57.35 129.4,52.55 196.2,52.55 203.2,45.55 CON-CURRENT1.P$4
CURRENT_SENSE_2  (via drill 0.41)
  Top 0.203: v141,66.55 141,89.55 139.2,91.35 C9.1
  Bottom 0.203: 142.2,65.35 v141,66.55 | 142.2,65.35 142.2,63.75 118.2,63.75 113.2,58.75 ADCL.7 | 142.2,65.35 144.2,67.35 166.2,67.35 167.6,65.95 193.8,65.95 203.2,56.55 CON-CURRENT2.P$4
DS18B20
  Top 0.203: R7.1 71.6,22.35 65,22.35 65,20.95 IC4.2
  Bottom 0.203: PWM(H).4 144.6,10.35 142,12.95 91.6,12.95 85.2,19.35 66.4,19.35 65,20.75 IC4.2
GND  (via drill 0.71)
  Top 0.305: 208.6,41.15 199,41.15 R17.2 | 208.6,41.15 208.6,37.75 CON-BATTSENSE.P$1 208.6,37.55 205,33.95 205,27.35 203.2,25.55 CON-EXT-IN.P$4 TELIT-POWERCON.P$3 TELIT-POWERCON.P$4 203.2,12.15 208.6,6.75 POWER_IN.P$1 | 208.6,41.15 208.6,45.35 CON-CURRENT1.P$2 208.6,45.55 206.8,47.35 206.8,54.55 208.6,56.35 CON-CURRENT2.P$2 | v194.4,23.35 194.4,25.55 193.8,26.15 C21.- | POWER.4 138.4,58.55 136,58.55 POWER.5 136,58.75 136,64.75 U$3.GND1 136,64.95 137.8,64.95 | 137.8,64.95 138.4,64.95 U$3.GND2 137.8,64.95 | 131.2,94.15 C1.2 127.6,94.15 v116.4,82.95 | 137.9,89.05 137.8,89.15 137.8,92.15 | 137.9,89.05 139.2,87.75 C7.2 | 137.8,92.15 137.8,92.95 139,94.15 C9.2 | 137.8,92.15 135.8,94.15 D2.ANODE 131.2,94.15 | 131.2,94.15 R12.1 | 137.8,64.95 137.8,88.95 137.9,89.05 | 170,85.15 170.8,85.15 U$5.12 | 170,85.15 165.2,85.15 U$5.9 | 170,89.15 170.8,89.15 U$5.18 | 170,85.15 170,89.15 | 170,89.15 170,92.75 169.4,93.35 C3.1 | 170,85.15 170,77.35 C8.- 172,75.35 v172,55.35 172,49.75 175,46.75 C10.2 175.2,46.55 176.6,46.55 | PWM(H).7 152.4,10.35 152.6,10.55 152.6,16.55 U$3.GND 152.8,16.75 160.4,24.35 183.6,24.35 | C23.- 169.2,36.55 169.2,33.95 175.2,33.95 C14.1 175.4,33.95 176.6,35.15 176.6,46.55 | 183.6,24.35 183.6,43.95 182.6,44.95 U$4.P$2 182.4,45.15 182.4,46.55 176.6,46.55 | 183.6,24.35 183.6,21.95 182.8,21.15 Q6.E | U$1.- 28.4,12.35 29.2,13.15 29.2,26.95 27.4,26.95 IC2.4 27.2,27.15 27.2,29.75 19.6,29.75 19.5,29.65 | 19.5,29.65 19.2,29.35 19.2,20.95 10.6,12.35 TELIT_COMMS.5 | 19.5,29.65 19.4,29.75 19.4,35.75 10.8,44.35 HYMERA_COMMS.5 10.6,44.55 9.4,45.75 9.4,47.15 8.2,48.35 HYMERA_COMMS.8 8,48.55 6,50.55 6,81.15 8,83.15 HYMERA_PASS.8 8.2,83.35 9.4,84.55 9.4,86.15 10.6,87.35 HYMERA_PASS.5
  Top 0.305: 36.6,48.15 31.8,48.15 31.8,42.75 IC1.15 | 30.2,65.15 35.2,65.15 35.2,61.35 | 30.2,65.15 23.6,65.15 23.4,64.95 23.4,59.95 23,59.55 C15.1 | 35.2,61.35 35.2,59.55 C13.2 35.4,59.35 36.6,58.15 36.6,48.15 | 30.2,65.15 30.2,82.95 33,85.75 GPS_BREAKOUT.1 | 36.6,48.15 C16.1 | 63.2,32.75 63.2,22.15 IC4.1 63,21.95 62,20.95 62,10.15 62.8,9.35 LCD_BREAKOUT.1 | 63.2,32.75 63.2,37.75 65.6,40.15 C6.2 | 63.2,32.75 71.6,32.75 72,33.15 72,49.15 70.6,50.55 C2.2 70.6,50.75 71,51.15 v71,55.95 | U$2.CASE3 102,93.15 101.6,92.75 101.6,78.95 U$2.CASE2 101.4,78.75 88.4,78.75 | 87.8,83.55 86.8,83.55 U$2.VSS 86.6,83.35 85,83.35 85,59.55 85.4,59.15 85.4,53.75 85.2,53.55 JP5.1 85,53.55 82.6,53.55 JP6.1 | 87.8,83.55 87.8,89.55 86.8,90.55 U$2.CASE1 | v71,82.15 71,80.75 67,80.75 IC3.8 | 87.8,83.55 v88.4,82.95 88.4,78.75 | 88.4,78.75 88.4,73.95 90.6,71.75 BREAKOUT.7 | 60.7,45.05 60.8,44.95 62,44.95 62,45.95 IC5.5 | 60.7,45.05 60.6,45.15 60.6,45.95 IC5.3 60.6,46.15 60.6,46.75 61.2,47.35 v61.2,52.95 61.2,54.35 IC5.21 | C5.2 58.4,40.35 60.6,42.55 60.6,44.95 60.7,45.05 | v51.2,55.95 51.2,55.55 52.4,54.35 C4.2 | 35.2,61.35 47.2,61.35 47.2,59.35 HYMERA_TP.1
  Bottom 0.305: v194.4,23.35 196.4,25.35 203.2,25.35 CON-EXT-IN.P$4 | v172,55.35 141.8,55.35 138.6,58.55 POWER.4 | CON-CURRENT1.P$2 208.6,45.35 207,43.75 183.8,43.75 182.6,44.95 U$4.P$2 | HYMERA_PASS.5 10.8,87.35 12.2,85.95 GPS_BREAKOUT.1 | JP7.6 50.8,13.75 52,12.55 59.6,12.55 62.8,9.35 LCD_BREAKOUT.1 | v71,82.15 71.8,82.95 v88.4,82.95 v116.4,82.95 | HYMERA_TP.1 47.4,59.15 48,59.15 v51.2,55.95 61.2,55.95 | 61.2,55.95 v71,55.95 80,55.95 82.4,53.55 JP6.1 | 61.2,55.95 v61.2,52.95
GPS_POWER
  Top 0.203: GPS_POWER_SEL.2 31,90.75 31,90.55 33,88.55 GPS_BREAKOUT.2
GPS_RX
  Top 0.203: GPS_BREAKOUT.3 33,90.95 48.6,75.35 48.6,9.15 51.2,6.55 115.4,6.55 115.4,10.15 PWM(L).1
GPS_TX  (via drill 0.41)
  Top 0.203: v104.2,90.75 116.8,78.15 116.8,11.55 118,10.35 PWM(L).2
  Bottom 0.203: v104.2,90.75 35.8,90.75 GPS_BREAKOUT.4
GSM_POWER
  Top 0.203: PWM(L).6 128.4,10.35 133.2,15.15 133.2,16.55 U$3.D7
GSM_POWER_FET
  Top 0.203: R2.2 181.6,16.15 178.2,12.75 153.6,12.75 153.6,9.15 152.8,8.35 125.8,8.35 125.8,10.15 PWM(L).5
GSM_RX
  Top 0.203: PWM(H).3 137.2,15.35 134.6,15.35 134.6,17.15 133.8,17.95 120.8,17.95 120.8,16.75 U$3.D2
GSM_TX
  Top 0.203: PWM(L).4 123.2,10.35 123.2,16.55 U$3.D3
HYMERA_232_RX  (via drill 0.41)
  Top 0.203: v22,52.55 24,52.55 IC1.8
  Bottom 0.203: 12.8,52.55 10.8,52.55 HYMERA_COMMS.2 | 12.8,52.55 v22,52.55 | 12.8,52.55 12.8,77.15 10.8,79.15 HYMERA_PASS.2
HYMERA_232_TX  (via drill 0.41)
  Top 0.203: v24.8,50.55 24.8,51.95 25.2,52.35 IC1.7
  Bottom 0.203: v24.8,50.55 24.2,49.95 22.8,49.95 | 22.8,49.95 10.8,49.95 HYMERA_COMMS.3 | 22.8,49.95 22.8,69.95 10.8,81.95 HYMERA_PASS.3
HYMERA_INHIBIT
  Top 0.203: HYMERA_COMMS.4 10.8,47.15 12.2,48.55 12.2,83.15 10.8,84.55 HYMERA_PASS.4
HYMERA_LOW_GAS
  Bottom 0.203: HYMERA_COMMS.1 10.8,55.35 10.8,59.95 11,59.95 12.2,61.15 12.2,76.35 10.8,76.35 HYMERA_PASS.1
HYMERA_REPROG_RX
  Bottom 0.203: HYMERA_PASS.6 8,77.75 6.6,77.75 6.6,52.75 8,51.35 HYMERA_COMMS.7 8,51.15 6.2,51.15 6.2,36.55 8.2,34.55 9,34.55 37,6.55 109.2,6.55 109.2,11.35 108.4,12.15 104.8,12.15 103,10.35 COMMUNICATION.5
HYMERA_REPROG_TX  (via drill 0.41)
  Top 0.203: HYMERA_COMMS.6 8,54.15 6.6,55.55 6.6,79.15 8,80.55 HYMERA_PASS.7 | v86.8,38.15 86.8,28.95 105.4,10.35 COMMUNICATION.6
  Bottom 0.203: v86.8,38.15 85.4,39.55 70,39.55 65,44.55 14.8,44.55 10.6,48.75 10.2,48.75 9.2,49.75 9.2,53.95 8.2,53.95 HYMERA_COMMS.6
HYMERA_TTL_RX  (via drill 0.41)
  Top 0.203: v59,50.55 59,49.15 57.6,49.15 IC5.30 | v24.6,45.35 24.6,43.15 24.2,42.75 IC1.9
  Bottom 0.203: v59,50.55 58.2,51.35 51.2,51.35 44.8,57.75 | 44.8,57.75 44.8,59.15 HYMERA_TP.2 | v24.6,45.35 37,57.75 44.8,57.75
HYMERA_TTL_TX  (via drill 0.41)
  Top 0.203: v56,48.35 57.4,48.35 IC5.31 | v47.8,48.75 42.4,54.15 42.4,59.15 HYMERA_TP.3 | v25.8,45.35 25.8,43.15 25.4,42.75 IC1.10
  Bottom 0.203: v56,48.35 55.6,48.75 v47.8,48.75 29.2,48.75 v25.8,45.35
LCD_RX
  Bottom 0.203: LCD_BREAKOUT.3 68.2,9.15 70.2,7.15 104.8,7.15 107.8,10.15 COMMUNICATION.7
LCD_TX
  Top 0.203: LCD_BREAKOUT.4 70.6,9.15 86.2,9.15 86.2,8.75 87.8,7.15 110.4,7.15 110.4,10.15 COMMUNICATION.8
MEGA_168_SS  (via drill 0.41)
  Top 0.203: v69.2,46.35 69.2,47.15 67.4,48.95 67.4,51.35 66.2,51.35 IC5.14
  Bottom 0.203: v69.2,46.35 69.6,45.95 82.4,45.95 JP2.5
MEGA_POWER_FET  (via drill 0.41)
  Top 0.203: v67.4,44.55 65,46.95 65,49.75 66,49.75 IC5.12 | v167.2,43.95 168.4,45.15 168.4,45.35 Q3.1
  Bottom 0.203: v67.4,44.55 143,44.55 143.6,43.95 v167.2,43.95
MEGA_RESET  (via drill 0.41)
  Top 0.203: v68.4,43.75 68.4,47.35 66.8,48.95 66.2,48.95 IC5.11 | v135.8,42.15 146,52.35 146,58.55 POWER.1
  Bottom 0.203: v68.4,43.75 70,42.15 v135.8,42.15
MISO  (via drill 0.41)
  Top 0.203: v69.6,52.55 69.6,52.95 66.2,52.95 IC5.16 | U$2.DAT0 86.6,82.15 85.6,82.15 85.6,80.35 86.2,79.75 86.2,49.55 85.2,48.55 JP2.4 | v51,52.75 50.8,52.55 50.8,15.55 51.8,14.55 51.8,10.15 53,8.95 JP7.1
  Bottom 0.203: 70.2,51.95 72.6,49.55 84,49.55 85,48.55 JP2.4 | 70.2,51.95 v69.6,52.55 | v51,52.75 51.8,51.95 70.2,51.95
MOSI  (via drill 0.41)
  Top 0.203: v68.4,51.15 68.4,52.15 66.2,52.15 IC5.15 | JP7.4 50.6,11.35 49.4,12.55 v49.4,49.55 50.2,50.35 50.2,68.55 v64.6,82.95 | v141.8,87.75 165,87.75 U$5.5 | v68.6,85.35 68.2,85.35 67.4,84.55 67,84.55 IC3.5
  Bottom 0.203: 69.8,49.75 71,48.55 82.4,48.55 JP2.3 | 69.8,49.75 v68.4,51.15 | v49.4,49.55 49.6,49.75 69.8,49.75 | v141.8,87.75 139.4,85.35 v68.6,85.35 67,85.35 v64.6,82.95
MOSI_3.3  (via drill 0.41)
  Top 0.203: v82.6,86.55 86.6,86.55 U$2.CMD | v68.6,86.55 68.2,86.55 67.6,85.95 67,85.95 IC3.4
  Bottom 0.203: v68.6,86.55 v82.6,86.55
N$2  (via drill 0.41)
  Top 0.203: Q6.C 181.8,23.15 181.8,18.95 184.4,16.35 R1.2 184.6,16.35 v186,17.75 | v188.8,20.55 191,20.55 Q1.1
  Bottom 0.203: v186,17.75 v188.8,20.55
N$3
  Bottom 0.61: F1.1 195.4,7.75 196.4,6.75 POWER_IN.P$2
N$4
  Top 0.203: U$6.S2ON 195.2,90.35 208.6,90.35 208.6,92.55 CON-RELAY1.P$1
N$5
  Top 0.203: R17.1 198.8,38.55 195.2,38.55 195.2,40.55 U$4.P$4
N$6  (via drill 0.41)
  Top 0.203: v28.2,22.15 28.2,22.35 27.4,23.15 IC2.1 | v35.6,22.15 37,23.55 Q5.P$1
  Bottom 0.203: v28.2,22.15 v35.6,22.15
N$7
  Top 0.203: IC2.3 27.2,25.95 24,25.95 24,27.75 22.6,29.15 19.8,29.15 19.8,12.55 20,12.35 U$1.+$2 20.2,12.15 20.2,8.55 32.8,8.55 36.4,12.15 U$1.+$1
N$8
  Top 0.203: IC5.8 64.6,45.95 68.4,42.15 C6.1 68.4,40.15 68.6,39.95 68.6,34.35 Q4.1
N$9  (via drill 0.41)
  Top 0.203: v25.6,25.15 25.6,24.75 27.2,24.75 IC2.2 | v34.8,25.55 37,27.75 Q5.P$2
  Bottom 0.203: v25.6,25.15 26,25.55 v34.8,25.55
N$10
  Top 0.203: SD_ACT.A 76.8,86.35 74.4,83.95 74.4,82.75 73.8,82.15 73,82.15 IC3.10
N$11
  Top 0.203: IC5.7 63.6,45.95 63.6,42.75 61.2,40.35 C5.1 61,40.15 59.2,38.35 59.2,34.35 Q4.2
N$12
  Top 0.203: U$6.S2COM 193,90.35 195.2,92.55 203,92.55 CON-RELAY1.P$2
N$14
  Top 0.203: U$7.S2ON 195.2,80.35 208.6,80.35 208.6,84.55 CON-RELAY2.P$1
N$15
  Top 0.203: U$7.S2COM 193,80.35 197.2,84.55 203,84.55 CON-RELAY2.P$2
N$16
  Top 0.203: U$8.S2ON 195.2,70.35 208.6,70.35 208.6,76.55 CON-RELAY3.P$1
N$17
  Top 0.203: U$8.S2COM 193,70.35 199.2,76.55 203,76.55 CON-RELAY3.P$2
N$18
  Top 0.203: SD_ACT.C 79.8,86.55 79.8,90.75 R10.2
N$19
  Top 0.203: U$9.S2ON 195.2,60.35 201.8,66.95 208.6,66.95 208.6,68.55 CON-RELAY4.P$1
N$20
  Top 0.203: U$9.S2COM 193,60.35 201.2,68.55 203,68.55 CON-RELAY4.P$2
N$21  (via drill 0.41)
  Top 0.203: v175.4,90.55 171,90.55 U$5.20 | v181.8,89.55 182.2,89.95 182.2,90.35 | 182.2,90.35 182.2,91.15 R13.1 | 182.2,90.35 187.4,90.35 U$6.COIL+
  Bottom 0.203: v175.4,90.55 176.4,89.55 v181.8,89.55
N$22  (via drill 0.41)
  Top 0.203: v176.8,90.35 176.8,89.75 171,89.75 U$5.19 | v181.8,93.55 182.2,93.95 182.2,95.15 R14.2 182.4,95.35 182.4,96.15 187.4,96.15 U$6.COIL-
  Bottom 0.203: v176.8,90.35 180,93.55 v181.8,93.55
N$23
  Top 0.203: 188.2,81.35 188.2,80.95 187.6,80.35 U$7.COIL+ | 188.2,81.35 188.2,97.55 178.8,97.55 177.6,96.35 177.6,88.55 171,88.55 U$5.17 | 188.2,81.35 182.4,81.35 R15.1
N$24
  Top 0.203: U$5.16 171,87.95 178.2,87.95 178.2,96.35 178.4,96.55 181,96.55 181,86.55 182.2,85.35 R16.2 182.4,85.35 182.4,86.15 187.4,86.15 U$7.COIL-
N$25  (via drill 0.41)
  Top 0.203: v172.8,80.75 172.8,86.55 171,86.55 U$5.14 | v180.8,72.75 182.2,71.35 R18.1 182.4,71.15 182.4,70.35 187.4,70.35 U$8.COIL+
  Bottom 0.203: v180.8,72.75 v172.8,80.75
N$26  (via drill 0.41)
  Top 0.203: v172,83.95 172,85.75 171,85.75 U$5.13 | v180.8,76.75 182.2,75.35 R19.2 182.4,75.35 182.4,76.15 187.4,76.15 U$8.COIL-
  Bottom 0.203: v172,83.95 179.2,76.75 v180.8,76.75
N$27
  Top 0.203: 182.2,60.35 182.2,61.15 R20.1 | 182.2,60.35 182.2,59.95 178.6,59.95 178.2,60.35 178.2,71.95 171.2,78.95 171.2,84.35 171,84.55 U$5.11 | 182.2,60.35 187.4,60.35 U$9.COIL+
N$28  (via drill 0.41)
  Top 0.203: v168.6,78.95 168.6,81.15 165.2,84.55 U$5.10 | v180.8,66.75 182.2,65.35 R21.2 182.4,65.35 182.4,66.15 187.4,66.15 U$9.COIL-
  Bottom 0.203: v180.8,66.75 v168.6,78.95
N$30
  Top 0.203: C12.1 27.8,60.55 27.8,52.55 IC1.5
N$31
  Top 0.203: C12.2 29,62.15 29,52.55 IC1.4
N$32
  Top 0.203: C11.1 30.6,52.55 IC1.3
N$33
  Top 0.203: C11.2 33,63.35 33,52.55 IC1.1
N$34
  Top 0.203: C13.1 33.6,54.95 33.6,51.35 33.4,51.15 31.8,51.15 31.8,52.35 IC1.2
N$35
  Top 0.203: C15.2 23,56.55 26.6,56.55 26.6,52.55 IC1.6
Q6BASE
  Top 0.203: Q6.B 180.6,20.95 179,19.35 179,16.35 R2.1
RELAY_CS
  Top 0.203: U$5.4 165,88.55 141.6,88.55 141.6,93.95 140.2,95.35 103.4,95.35 103.4,76.75 99.4,72.75 99.4,59.95 99,59.55 99,57.35 86.2,44.55 82.6,44.55 82.6,43.35 JP2.7
SCK  (via drill 0.41)
  Top 0.203: v142.8,86.95 142.8,87.15 165,87.15 U$5.6 | v74.8,81.95 73.6,80.75 73,80.75 IC3.9 72.8,80.55 72.8,79.95 | 70.2,60.15 72.8,62.75 72.8,79.95 | 70.2,60.15 64.6,54.55 IC5.17 64.4,54.55 64.4,55.55 58.4,55.55 58.2,55.35 58.2,53.75 59.8,52.15 59.8,48.35 56,44.55 56,14.15 JP7.3 | 72.8,79.95 65.6,79.95 65.4,80.15 65.4,86.95 66.8,86.95 IC3.3 | 70.2,60.15 v78,52.35
  Bottom 0.203: v142.8,86.95 137.8,81.95 v74.8,81.95 | v78,52.35 83.6,52.35 85,50.95 JP2.2
SCK_3.3
  Top 0.203: U$2.CLK 86.6,84.55 80.8,84.55 80.8,91.95 80.6,92.15 68.2,92.15 68.2,89.15 67.4,88.35 67,88.35 IC3.2
SCL  (via drill 0.41)
  Top 0.203: v33,30.75 33,33.35 33.4,33.75 R5.1 | v23.2,27.15 22,25.95 21.4,25.95 IC2.6
  Bottom 0.203: v23.2,27.15 29.4,27.15 v33,30.75 42.8,20.95 63,20.95 67.2,16.75 86.2,16.75 92.6,10.35 COMMUNICATION.1
SD_SEL  (via drill 0.41)
  Top 0.203: JP2.1 82.4,50.95 79.8,53.55 79.8,81.95 R6.2 79.6,82.15 v77.8,83.95 | v69.6,82.15 67,82.15 IC3.7
  Bottom 0.203: v69.6,82.15 71.4,83.95 v77.8,83.95
SD_SEL_3.3  (via drill 0.41)
  Top 0.203: v82.6,87.95 86.6,87.95 U$2.DAT3 | v78.6,89.15 77,90.75 R10.1 76.8,90.75 72.2,90.75 71.6,90.15 71.6,83.35 67,83.35 IC3.6
  Bottom 0.203: v82.6,87.95 81.4,89.15 v78.6,89.15
SDA  (via drill 0.41)
  Top 0.203: v24.6,30.75 24.6,32.95 25.4,33.75 R9.2 | v22.2,28.35 21.4,27.55 21.4,27.15 IC2.5 | v86.8,20.35 86.8,18.75 95.2,10.35 COMMUNICATION.2
  Bottom 0.203: v22.2,28.35 v24.6,30.75 25.4,31.55 55.6,31.55 65.4,21.75 85.4,21.75 v86.8,20.35
TELIT_232_RX  (via drill 0.41)
  Top 0.203: v28.6,38.75 28.6,42.15 29,42.55 IC1.13 | v18,28.15 10.6,20.75 10.6,20.55 TELIT_COMMS.2
  Bottom 0.203: v18,28.15 v28.6,38.75
TELIT_232_TX  (via drill 0.41)
  Top 0.203: v29.8,38.15 29.8,41.95 30.4,42.55 IC1.14 | v18.2,26.55 10.6,18.95 10.6,17.75 TELIT_COMMS.3
  Bottom 0.203: v18.2,26.55 v29.8,38.15
TELIT_TTL_RX  (via drill 0.41)
  Top 0.203: v30.6,35.55 27.8,38.35 27.8,42.55 IC1.12 | v86.2,24.15 97.6,12.75 97.6,10.35 COMMUNICATION.3
  Bottom 0.203: v30.6,35.55 34,32.15 74.4,32.15 82.4,24.15 v86.2,24.15
TELIT_TTL_TX  (via drill 0.41)
  Top 0.203: v27,40.75 27,42.35 26.8,42.55 IC1.11 | v86.2,26.75 100.2,12.75 100.2,10.35 COMMUNICATION.4
  Bottom 0.203: v27,40.75 28.2,39.55 69.4,39.55 82.2,26.75 v86.2,26.75